# Altium schematic sheet Relay_Control.SchDoc
size A; SheetNumber: 9; SheetTotal: 13
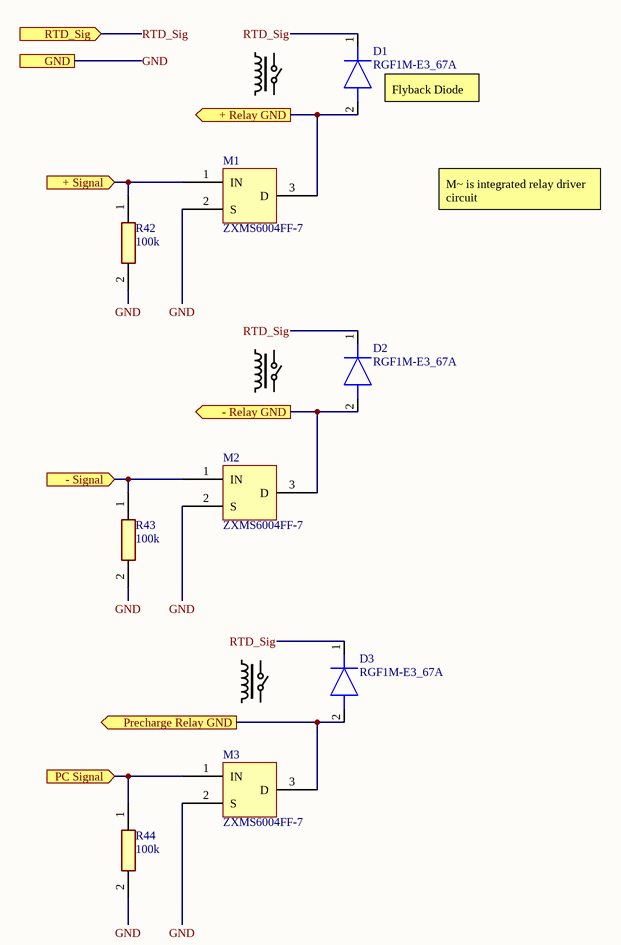
[diagram p0: Relay_Control.SchDoc]

## Parts
D1  RGF1M-E3_67A  [DIOM5426X300N]
D2  RGF1M-E3_67A  [DIOM5426X300N]
D3  RGF1M-E3_67A  [DIOM5426X300N]
M1  ZXMS6004FF-7  [SOT95P240X100-3N]
M2  ZXMS6004FF-7  [SOT95P240X100-3N]
M3  ZXMS6004FF-7  [SOT95P240X100-3N]
R42  100k  [RESC1608X55N]
R43  100k  [RESC1608X55N]
R44  100k  [RESC1608X55N]

## Ports
+ Relay GND (out), + Signal (in), - Relay GND (out), - Signal (in), GND, PC Signal (in), Precharge Relay GND (out), RTD_Sig (in)

## Nets
+ Relay GND: D1.2(A) M1.3(D) ; port + Relay GND
+ Signal: M1.1(IN) R42.1 ; port + Signal
- Relay GND: D2.2(A) M2.3(D) ; port - Relay GND
- Signal: M2.1(IN) R43.1 ; port - Signal
GND: M1.2(S) M2.2(S) M3.2(S) R42.2 R43.2 R44.2 ; port GND
PC Signal: M3.1(IN) R44.1 ; port PC Signal
Precharge Relay GND: D3.2(A) M3.3(D) ; port Precharge Relay GND
RTD_Sig: D1.1(K) D2.1(K) D3.1(K) ; port RTD_Sig

## Notes on the sheet
- (near D1) Flyback Diode
- M~ is integrated relay driver circuit

## Library data of the parts
D1-D3 = RGF1M-E3_67A: Diode; Manufacturer_Name: Vishay; Manufacturer_Part_Number: RGF1M-E3/67A; Datasheet Link: https://www.vishay.com/docs/88697/rgf1.pdf; Height: 3mm; Mouser Part Number: 625-RGF1M-E3; Mouser Price/Stock: https://www.mouser.co.uk/ProductDetail/Vishay-General-Semiconductor/RGF1M-E3-67A?qs=4xyK702%2F%252BQ1dl%252BTCdyIThg%3D%3D; Arrow Part Number: RGF1M-E3/67A; Arrow Price/Stock: https://www.arrow.com/en/products/rgf1m-e367a/vishay?region=nac
R42-R44 = CR0603-JW-104ELF: Resistor; Manufacturer_Name: Bourns; Datasheet Link: https://www.bourns.com/pdfs/chpreztr.pdf; Height: 0.55mm; Manufacturer_Part_Number: CR0603-JW-104ELF; Mouser Part Number: 652-CR0603-JW-104ELF; Mouser Price/Stock: https://www.mouser.co.uk/ProductDetail/Bourns/CR0603-JW-104ELF?qs=wOX%252BDVkMoZSK2gq9cFrtRg%3D%3D; Arrow Part Number: CR0603-JW-104ELF; Arrow Price/Stock: https://www.arrow.com/en/products/cr0603-jw-104elf/bourns?region=nac